# EAGLE schematic Module_control (EAGLE 9.4.2)

## Sheet 1 of 4
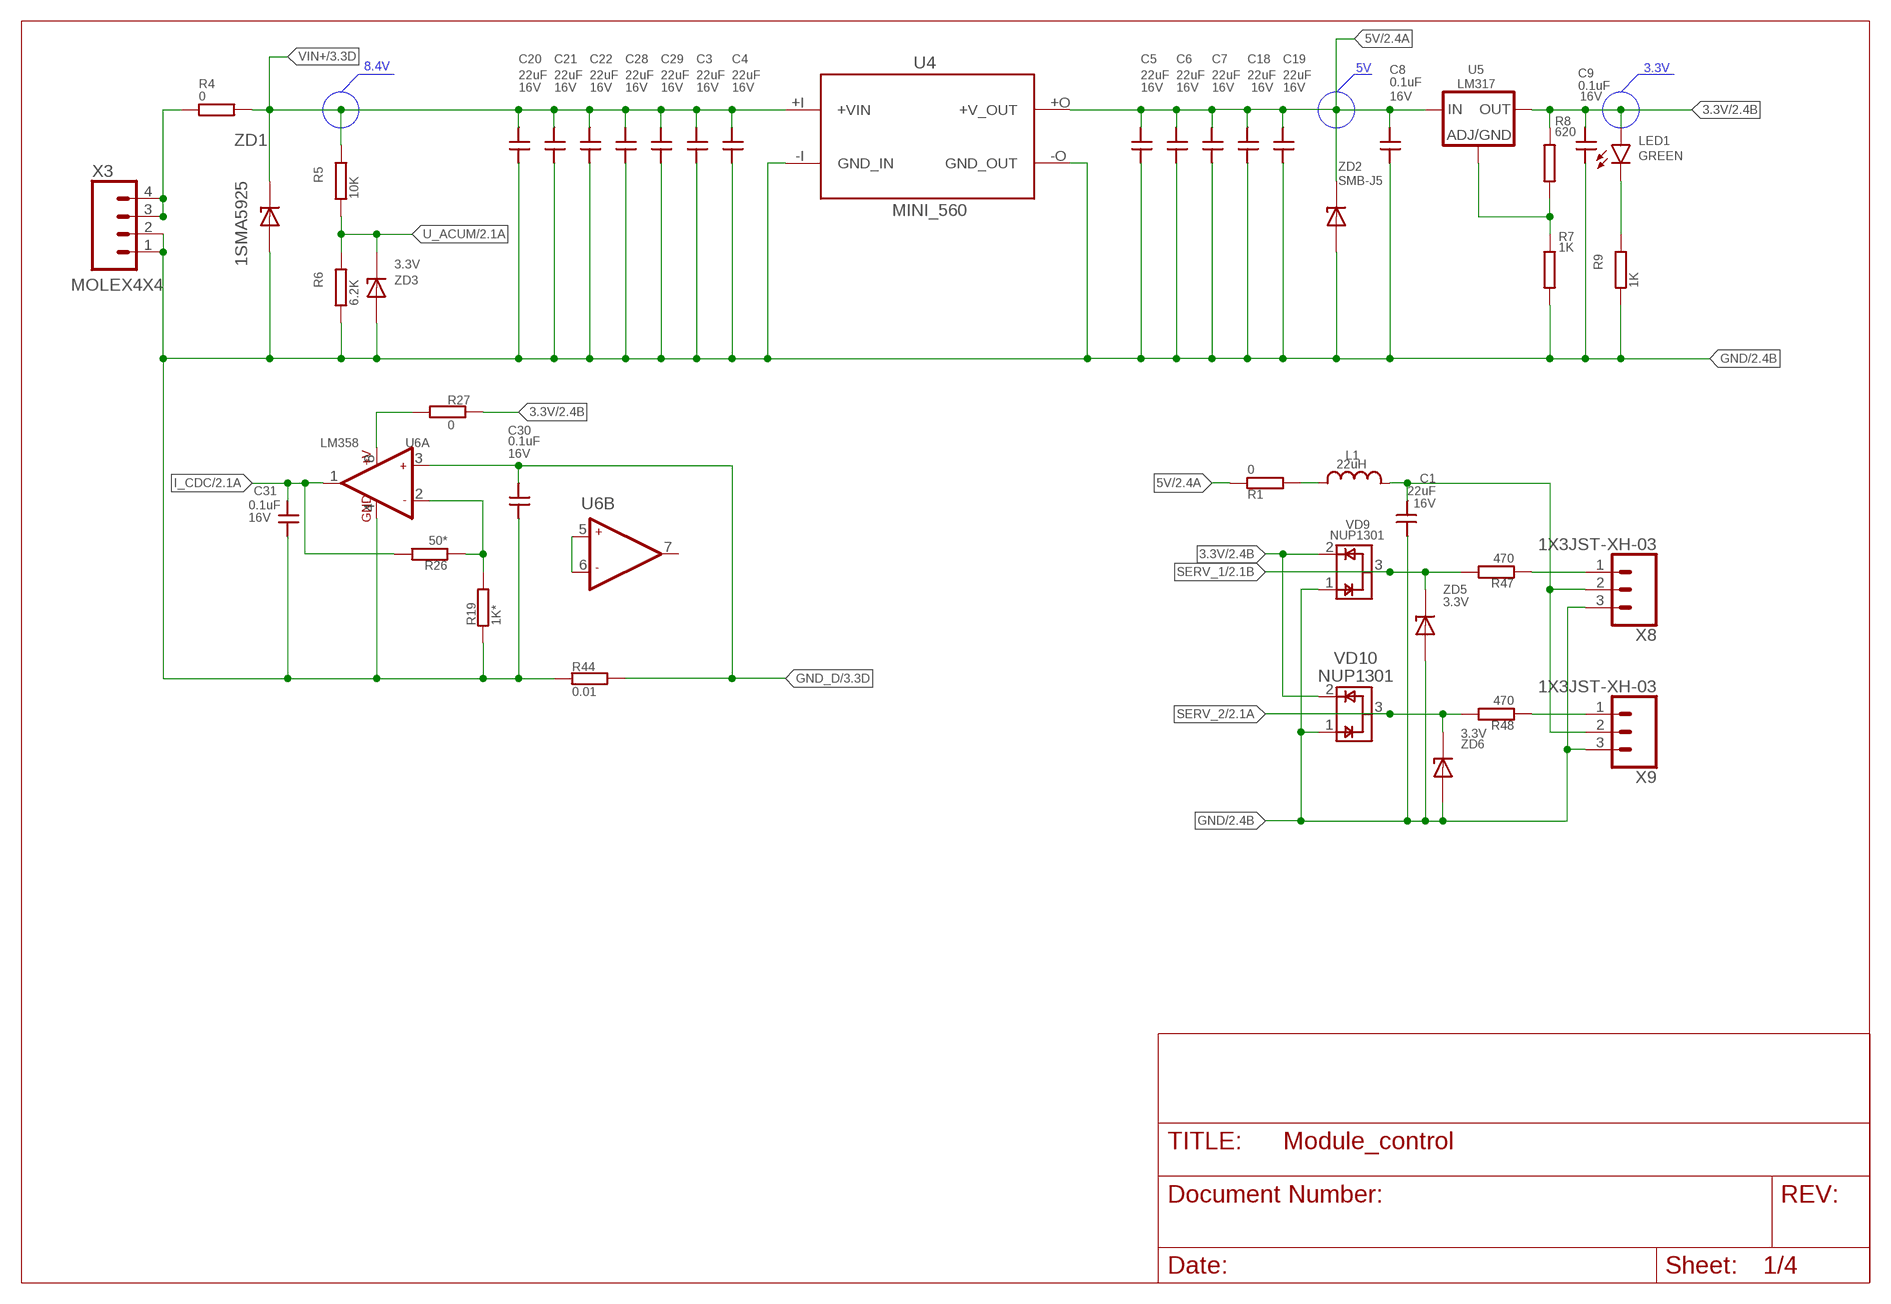
[diagram p0: schematic, sheet 1]

### Parts
C1  22uF  C1206  [1206]
C3  22uF  C1206  [1206]
C4  22uF  C1206  [1206]
C5  22uF  C1206  [1206]
C6  22uF  C1206  [1206]
C7  22uF  C1206  [1206]
C8  0.1uF  C0603  [0603]
C9  0.1uF  C0603  [0603]
C18  22uF  C1206  [1206]
C19  22uF  C1206  [1206]
C20  22uF  C1206  [1206]
C21  22uF  C1206  [1206]
C22  22uF  C1206  [1206]
C28  22uF  C1206  [1206]
C29  22uF  C1206  [1206]
C30  0.1uF  C0603  [0603]
C31  0.1uF  C0603  [0603]
L1  22uH  INDUCTOR0420CDMC  [0420CDMC]
LED1  GREEN  LED1608  [1608]
R1  0  R0603  [0603]
R4  0  R2512  [2512]
R5  10K  R0603  [0603]
R6  6.2K  R0603  [0603]
R7  1K  R0603  [0603]
R8  620  R0603  [0603]
R9  1K  R0603  [0603]
R19  1K*  R0603  [0603]
R26  50*  R0603  [0603]
R27  0  R0603  [0603]
R44  0.01  R1206  [1206]
R47  470  R0603  [0603]
R48  470  R0603  [0603]
U4  MINI_560  MINI560  [MINI560_OTB]
U5  LM317  [D-PAK]
U6  LM358  OPAMPDUALU  [SOIC-8]
VD9  NUP1301  ESD_PROTECTIONSOT123  [SOT23]
VD10  NUP1301  ESD_PROTECTIONSOT123  [SOT23]
X3  MOLEX4X4  1X4MOLEX-2X2U  [MOLEX-2X2U]
X8  1X3JST-XH-03  [JST-XH-03]
X9  1X3JST-XH-03  [JST-XH-03]
ZD1  1SMA5925  ZENER-DIODESSMB  [SMB]
ZD2  SMB-J5  ZENER-DIODESSMB  [SMB]
ZD3  3.3V  ZENER-DIODESMINIMELF  [MINIMELF]
ZD5  3.3V  ZENER-DIODESMINIMELF  [MINIMELF]
ZD6  3.3V  ZENER-DIODESMINIMELF  [MINIMELF]

### Nets
3.3V: C9.P$2 LED1.P$2(A) R8.P$2 R27.P$2 U5.4(OUT) VD9.2(VCC) VD10.2(VCC) ; also sheet 2,3,4
5: L1.2 R1.P$2
5V: C5.P$2 C6.P$2 C7.P$2 C8.P$2 C18.P$2 C19.P$2 R1.P$1 U4.+O(+V_OUT) U5.3(IN) ZD2.C ; also sheet 2,4
GND: C1.P$1 C3.P$1 C4.P$1 C5.P$1 C6.P$1 C7.P$1 C8.P$1 C9.P$1 C18.P$1 C19.P$1 C20.P$1 C21.P$1 C22.P$1 C28.P$1 C29.P$1 C30.P$1 C31.P$1 R6.P$1 R7.P$2 R9.P$1 R19.P$1 R44.P$1 U4.-I(GND_IN) U4.-O(GND_OUT) U6.4(A:GND) VD9.1(GND) VD10.1(GND) X3.1 X3.2 X8.3 X9.3 ZD1.A ZD2.A ZD3.A ZD5.A ZD6.A ; also sheet 2,3,4
GND_D: C30.P$2 R44.P$2 U6.3(A:+IN1) ; also sheet 3
I_CDC: C31.P$2 R26.P$2 U6.1(A:OUT1) ; also sheet 2
N$9: R48.P$1 X9.1
N$13: R7.P$1 R8.P$1 U5.1(ADJ/GND)
N$14: LED1.P$1(C) R9.P$2
N$16: R4.1 X3.3 X3.4
N$17: R47.P$1 X8.1
N$29: R19.P$2 R26.P$1 U6.2(A:-IN1)
N$32: U6.5(B:+IN2) U6.6(B:-IN2)
SERV_1: R47.P$2 VD9.3(I/O) ZD5.C ; also sheet 2
SERV_2: R48.P$2 VD10.3(I/O) ZD6.C ; also sheet 2
U_ACUM: R5.P$1 R6.P$2 ZD3.C ; also sheet 2
V+: R27.P$1 U6.8(A:+V)
VIN+: C3.P$2 C4.P$2 C20.P$2 C21.P$2 C22.P$2 C28.P$2 C29.P$2 R4.2 R5.P$2 U4.+I(+VIN) ZD1.C ; also sheet 3,4
VSERV: C1.P$2 L1.1 X8.2 X9.2
Unconnected: U6.7(B:OUT2)

### Notes on the sheet
- 8.4V | 5V | 3.3V

## Sheet 2 of 4
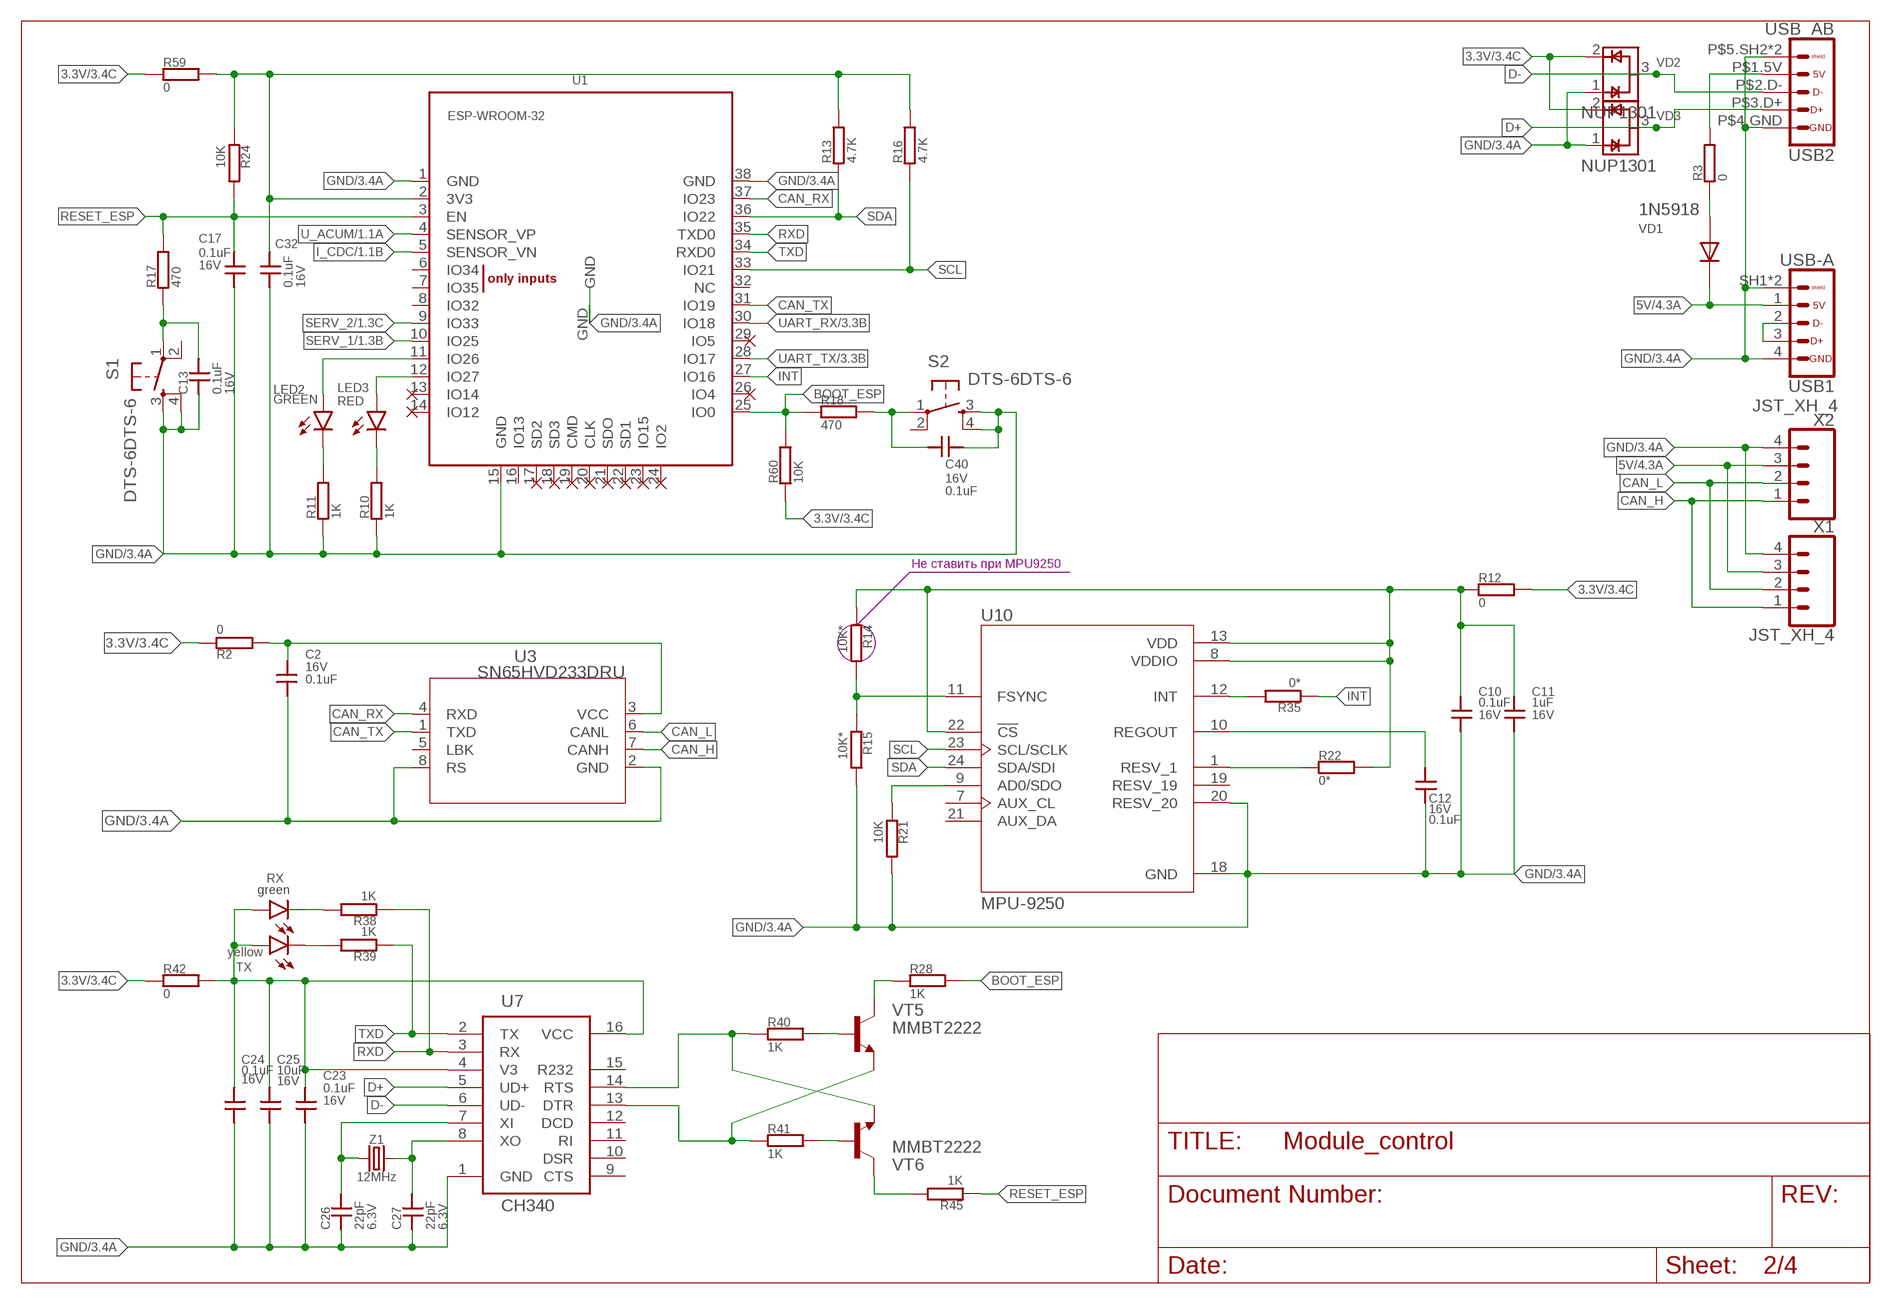
[diagram p1: schematic, sheet 2]

### Parts
C2  0.1uF  C0603  [0603]
C10  0.1uF  C0603  [0603]
C11  1uF  C0603  [0603]
C12  0.1uF  C0603  [0603]
C13  0.1uF  C0603  [0603]
C17  0.1uF  C0603  [0603]
C23  0.1uF  C0603  [0603]
C24  0.1uF  C0603  [0603]
C25  10uF  C0603  [0603]
C26  22pF  C0603  [0603]
C27  22pF  C0603  [0603]
C32  0.1uF  C0603  [0603]
C40  0.1uF  C0603  [0603]
LED2  GREEN  LED1608  [1608]
LED3  RED  LED1608  [1608]
R2  0  R0603  [0603]
R3  0  R0603  [0603]
R10  1K  R0603  [0603]
R11  1K  R0603  [0603]
R12  0  R0603  [0603]
R13  4.7K  R0603  [0603]
R14  10K*  R0603  [0603]
R15  10K*  R0603  [0603]
R16  4.7K  R0603  [0603]
R17  470  R0603  [0603]
R18  470  R0603  [0603]
R21  10K  R0603  [0603]
R22  0*  R0603  [0603]
R24  10K  R0603  [0603]
R28  1K  R0603  [0603]
R35  0*  R0603  [0603]
R38  1K  R0603  [0603]
R39  1K  R0603  [0603]
R40  1K  R0603  [0603]
R41  1K  R0603  [0603]
R42  0  R0603  [0603]
R45  1K  R0603  [0603]
R59  0  R0603  [0603]
R60  10K  R0603  [0603]
RX  green  LED2013  [2013]
S1  DTS-6DTS-6  [DTS-6]
S2  DTS-6DTS-6  [DTS-6]
TX  yellow  LED2013  [2013]
U1  ESP-WROOM-32  [ESP-WROOM-32]
U3  SN65HVD233DRU  [SOIC-8]
U7  CH340  [SOIC-16]
U10  MPU-9250  [QFN40P300X300X105-24N]
USB1  USB-A  [A-VERTICAL]
USB2  USB_AB  USB-B  [B-VERTICAL]
VD1  1N5918  DIODESOD-123  [SOD123]
VD2  NUP1301  ESD_PROTECTIONSOT123  [SOT23]
VD3  NUP1301  ESD_PROTECTIONSOT123  [SOT23]
VT5  MMBT2222  NPNSOT-23  [SOT-23]
VT6  MMBT2222  NPNSOT-23  [SOT-23]
X1  JST_XH_4  1X4JST-XH-04  [JST-XH-04]
X2  JST_XH_4  1X4JST-XH-04  [JST-XH-04]
Z1  12MHz  CRYSTAL4FOOT  [CRYSTAL-SMD-3.2X2.5MM]

### Nets
3.3V: R2.P$1 R12.P$2 R42.P$1 R59.P$1 R60.P$1 VD2.2(VCC) VD3.2(VCC) ; also sheet 1,3,4
5V: USB1.1 VD1.C X1.3 X2.3 ; also sheet 1,4
+3.3: C2.P$2 R2.P$2 U3.3(VCC)
+3V: C10.P$2 C11.P$2 R12.P$1 R14.P$1 R22.P$2 U10.8(VDDIO) U10.13(VDD) U10.22(!CS)
BOOT_ESP: R18.P$1 R28.P$2 R60.P$2 U1.25(IO0)
CAN_H: U3.7(CANH) X1.1 X2.1
CAN_L: U3.6(CANL) X1.2 X2.2
CAN_RX: U1.37(IO23) U3.4(RXD)
CAN_TX: U1.31(IO19) U3.1(TXD)
D+: U7.5(UD+) USB2.P$3.D+ VD3.3(I/O)
D-: U7.6(UD-) USB2.P$2.D- VD2.3(I/O)
DTR: R41.P$1 U7.13(DTR) VT5.2(E)
ESP_3.3V: C32.P$2 R13.P$2 R16.P$2 R24.P$1 R59.P$2 U1.2(3V3)
GND: C2.P$1 C10.P$1 C11.P$1 C12.P$1 C13.P$1 C17.P$1 C23.P$1 C24.P$1 C25.P$1 C26.P$1 C27.P$1 C32.P$1 C40.P$1 R10.P$1 R11.P$1 R15.P$2 R21.P$2 S1.3 S1.4 S2.3 S2.4 U1.1(GND) U1.15(GND) U1.38(GND) U1.GND U3.2(GND) U3.8(RS) U7.1(GND) U10.18(GND) U10.20(RESV_20) USB1.4 USB1.SH1(SHIELD) USB1.SH2(SHIELD) USB2.P$4.GND USB2.P$5.SH2(SHIELD) USB2.P$6.SH1(SHIELD) VD2.1(GND) VD3.1(GND) X1.4 X2.4 ; also sheet 1,3,4
I_CDC: U1.5(SENSOR_VN) ; also sheet 1
INT: R35.P$1 U1.27(IO16)
IT: R35.P$2 U10.12(INT)
N$3: C40.P$2 R18.P$2 S2.1
N$5: R3.P$2 USB2.P$1.5V
N$6: USB1.2 USB1.3
N$8: R3.P$1 VD1.A
N$12: LED2.P$2(A) U1.11(IO26)
N$15: LED3.P$2(A) U1.12(IO27)
N$18: LED3.P$1(C) R10.P$2
N$19: LED2.P$1(C) R11.P$2
N$22: R21.P$1 U10.9(AD0/SDO)
N$23: C12.P$2 U10.10(REGOUT)
N$25: R22.P$1 U10.1(RESV_1)
N$30: R38.P$2 RX.P$1(C)
N$31: R14.P$2 R15.P$1 U10.11(FSYNC)
N$33: R39.P$2 TX.P$1(C)
N$34: C27.P$2 U7.8(XO) Z1.3
N$35: C26.P$2 U7.7(XI) Z1.1
N$36: R40.P$2 VT5.1(B)
N$37: R41.P$2 VT6.1(B)
N$38: R28.P$1 VT5.3(C)
N$39: R45.P$2 VT6.3(C)
N$83: C13.P$2 R17.P$1 S1.1
RESET_ESP: C17.P$2 R17.P$2 R24.P$2 R45.P$1 U1.3(EN)
RTS: R40.P$1 U7.14(RTS) VT6.2(E)
RXD: R38.P$1 U1.35(TXD0) U7.3(RX)
SCL: R16.P$1 U1.33(IO21) U10.23(SCL/SCLK)
SDA: R13.P$1 U1.36(IO22) U10.24(SDA/SDI)
SERV_1: U1.10(IO25) ; also sheet 1
SERV_2: U1.9(IO33) ; also sheet 1
TXD: R39.P$1 U1.34(RXD0) U7.2(TX)
U_ACUM: U1.4(SENSOR_VP) ; also sheet 1
UART_RX: U1.30(IO18) ; also sheet 3
UART_TX: U1.28(IO17) ; also sheet 3
VCC: C23.P$2 C24.P$2 C25.P$2 R42.P$2 RX.P$2(A) TX.P$2(A) U7.4(V3) U7.16(VCC)
Unconnected: S1.2 S2.2 U1.6(IO34) U1.7(IO35) U1.8(IO32) U1.13(IO14) U1.14(IO12) U1.16(IO13) U1.17(SD2) U1.18(SD3) U1.19(CMD) U1.20(CLK) U1.21(SDO) U1.22(SD1) U1.23(IO15) U1.24(IO2) U1.26(IO4) U1.29(IO5) U1.32(NC) U3.5(LBK) U7.9(CTS) U7.10(DSR) U7.11(RI) U7.12(DCD) U7.15(R232) U10.7(AUX_CL) U10.19(RESV_19) U10.21(AUX_DA)

### Notes on the sheet
- Не ставить при MPU9250

## Sheet 3 of 4
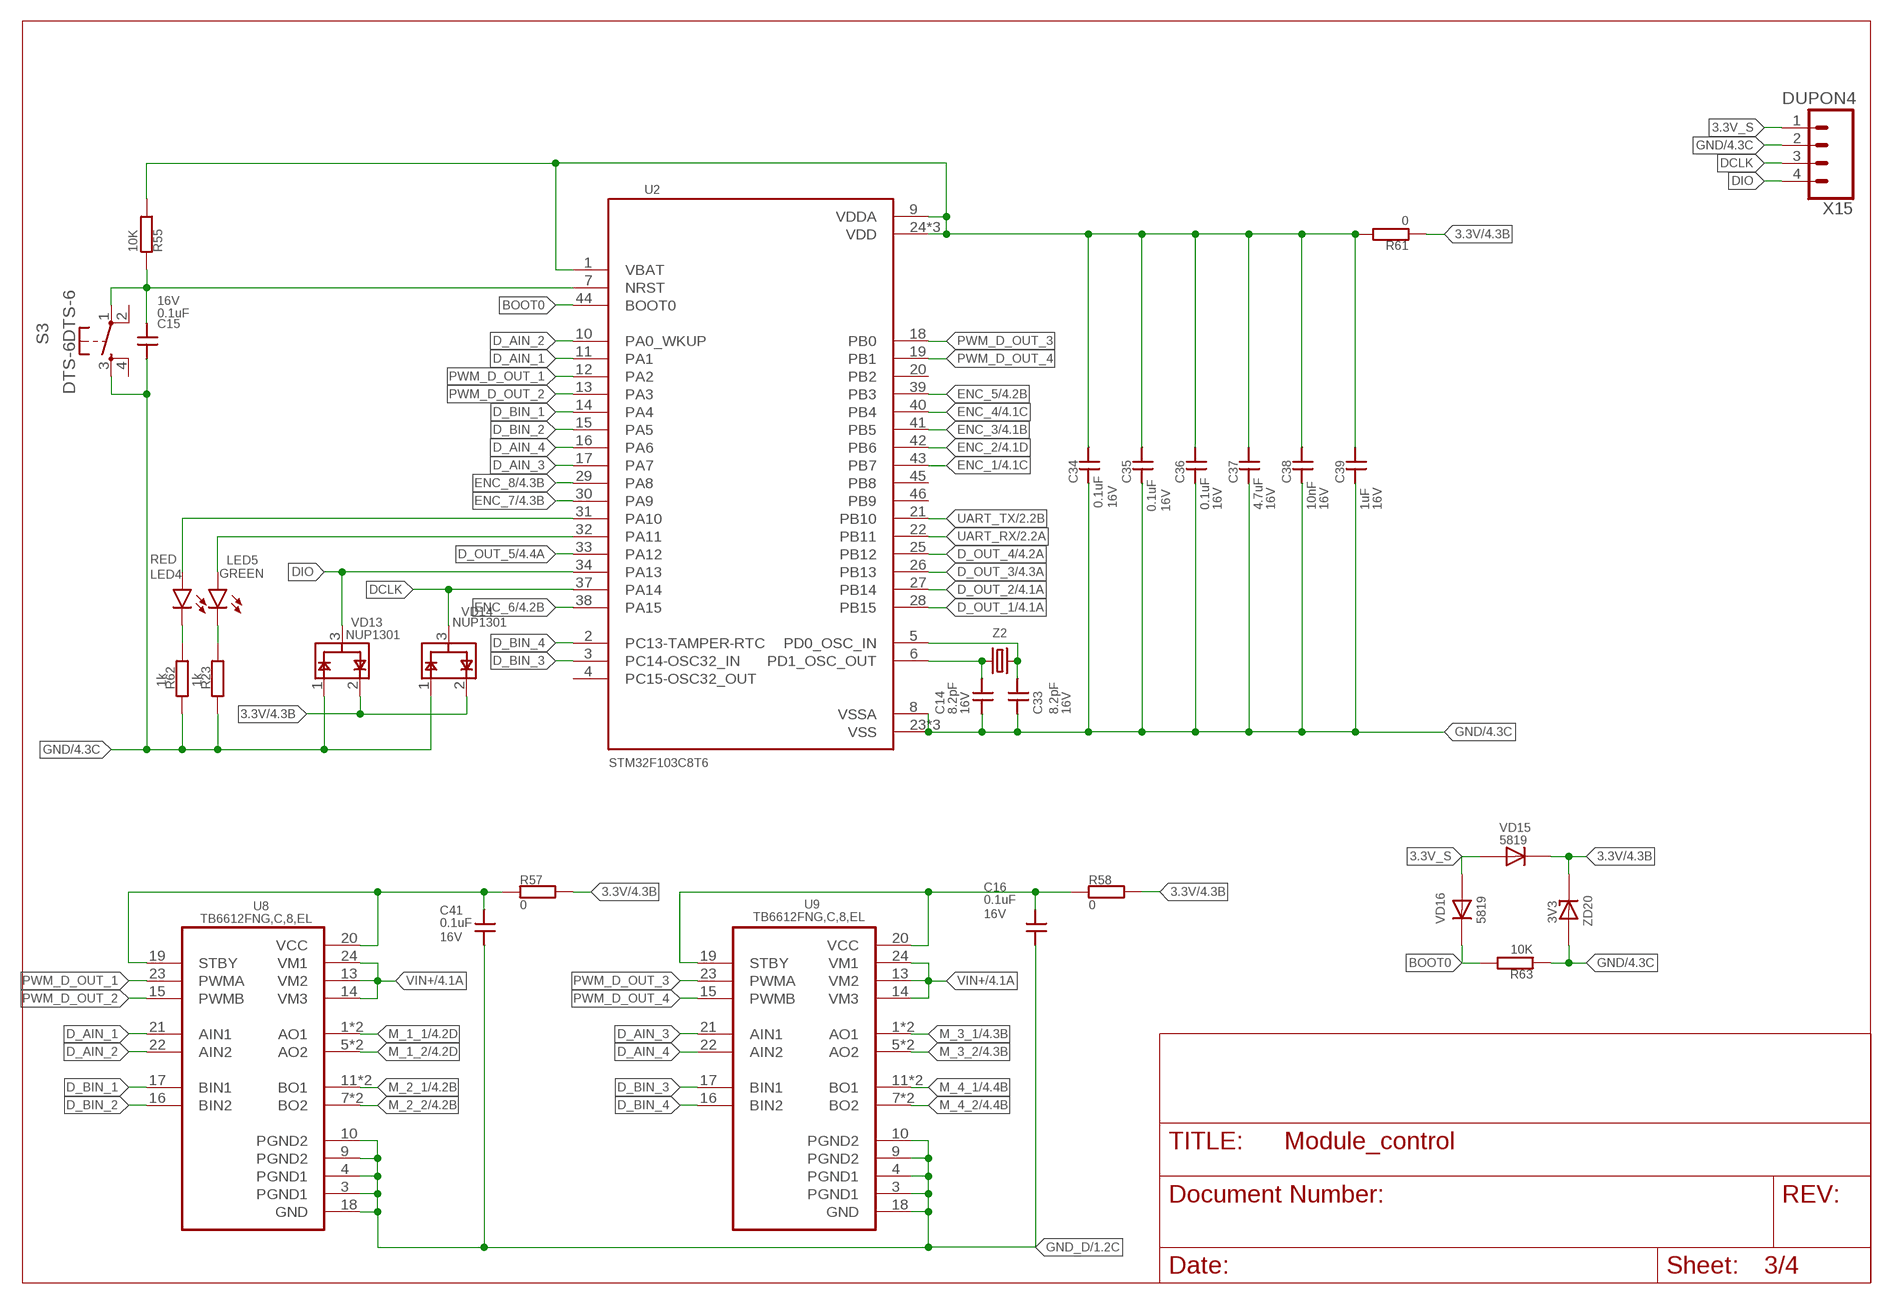
[diagram p2: schematic, sheet 3]

### Parts
C14  8.2pF  C0603  [0603]
C15  0.1uF  C0603  [0603]
C16  0.1uF  C0603  [0603]
C33  8.2pF  C0603  [0603]
C34  0.1uF  C0603  [0603]
C35  0.1uF  C0603  [0603]
C36  0.1uF  C0603  [0603]
C37  4.7uF  C0603  [0603]
C38  10nF  C0603  [0603]
C39  1uF  C0603  [0603]
C41  0.1uF  C0603  [0603]
LED4  RED  LED1608  [1608]
LED5  GREEN  LED1608  [1608]
R23  1k  R0603  [0603]
R55  10K  R0603  [0603]
R57  0  R0603  [0603]
R58  0  R0603  [0603]
R61  0  R0603  [0603]
R62  1k  R0603  [0603]
R63  10K  R0603  [0603]
S3  DTS-6DTS-6  [DTS-6]
U2  STM32F103C8T6  [QFP50P900X900X160-48N]
U8  TB6612FNG,C,8,EL  [SOP65]
U9  TB6612FNG,C,8,EL  [SOP65]
VD13  NUP1301  ESD_PROTECTIONSOT123  [SOT23]
VD14  NUP1301  ESD_PROTECTIONSOT123  [SOT23]
VD15  5819  DIODESOD-123  [SOD123]
VD16  5819  DIODESOD-123  [SOD123]
X15  DUPON4  1X4DUPON  [1X04DUPON]
Z2  8MHz  CRYSTAL4FOOT  [CRYSTAL-SMD-3.2X2.5MM]
ZD20  3V3  ZENER-DIODESMINIMELF  [MINIMELF]

### Nets
3.3V: R57.P$2 R58.P$2 R61.P$1 VD13.2(VCC) VD14.2(VCC) VD15.C ZD20.C ; also sheet 1,2,4
3.3V_S: VD15.A VD16.A X15.1
+VC: C41.P$2 R57.P$1 U8.19(STBY) U8.20(VCC)
BOOT0: R63.P$2 U2.44(BOOT0) VD16.C
D_AIN_1: U2.11(PA1) U8.21(AIN1)
D_AIN_2: U2.10(PA0_WKUP) U8.22(AIN2)
D_AIN_3: U2.17(PA7) U9.21(AIN1)
D_AIN_4: U2.16(PA6) U9.22(AIN2)
D_BIN_1: U2.14(PA4) U8.17(BIN1)
D_BIN_2: U2.15(PA5) U8.16(BIN2)
D_BIN_3: U2.3(PC14-OSC32_IN) U9.17(BIN1)
D_BIN_4: U2.2(PC13-TAMPER-RTC) U9.16(BIN2)
D_OUT_1: U2.28(PB15) ; also sheet 4
D_OUT_2: U2.27(PB14) ; also sheet 4
D_OUT_3: U2.26(PB13) ; also sheet 4
D_OUT_4: U2.25(PB12) ; also sheet 4
D_OUT_5: U2.33(PA12) ; also sheet 4
DCLK: U2.37(PA14) VD14.3(I/O) X15.3
DIO: U2.34(PA13) VD13.3(I/O) X15.4
ENC_1: U2.43(PB7) ; also sheet 4
ENC_2: U2.42(PB6) ; also sheet 4
ENC_3: U2.41(PB5) ; also sheet 4
ENC_4: U2.40(PB4) ; also sheet 4
ENC_5: U2.39(PB3) ; also sheet 4
ENC_6: U2.38(PA15) ; also sheet 4
ENC_7: U2.30(PA9) ; also sheet 4
ENC_8: U2.29(PA8) ; also sheet 4
GND: C14.P$1 C15.P$2 C33.P$1 C34.P$1 C35.P$1 C36.P$1 C37.P$1 C38.P$1 C39.P$1 R23.P$2 R62.P$2 R63.P$1 S3.3 U2.8(VSSA) U2.23(VSS) U2.35(VSS) U2.47(VSS) VD13.1(GND) VD14.1(GND) X15.2 ZD20.A ; also sheet 1,2,4
GND_D: C16.P$1 C41.P$1 U8.3(PGND1) U8.4(PGND1) U8.9(PGND2) U8.10(PGND2) U8.18(GND) U9.3(PGND1) U9.4(PGND1) U9.9(PGND2) U9.10(PGND2) U9.18(GND) ; also sheet 1
M_1_1: U8.1(AO1) U8.2(AO1) ; also sheet 4
M_1_2: U8.5(AO2) U8.6(AO2) ; also sheet 4
M_2_1: U8.11(BO1) U8.12(BO1) ; also sheet 4
M_2_2: U8.7(BO2) U8.8(BO2) ; also sheet 4
M_3_1: U9.1(AO1) U9.2(AO1) ; also sheet 4
M_3_2: U9.5(AO2) U9.6(AO2) ; also sheet 4
M_4_1: U9.11(BO1) U9.12(BO1) ; also sheet 4
M_4_2: U9.7(BO2) U9.8(BO2) ; also sheet 4
N$21: LED4.P$1(C) R62.P$1
N$42: C16.P$2 R58.P$1 U9.19(STBY) U9.20(VCC)
N$54: LED5.P$1(C) R23.P$1
N$58: LED4.P$2(A) U2.31(PA10)
N$87: LED5.P$2(A) U2.32(PA11)
N$89: C14.P$2 U2.6(PD1_OSC_OUT) Z2.1
N$90: C33.P$2 U2.5(PD0_OSC_IN) Z2.3
NRST: C15.P$1 R55.P$1 S3.1 U2.7(NRST)
PWM_D_OUT_1: U2.12(PA2) U8.23(PWMA)
PWM_D_OUT_2: U2.13(PA3) U8.15(PWMB)
PWM_D_OUT_3: U2.18(PB0) U9.23(PWMA)
PWM_D_OUT_4: U2.19(PB1) U9.15(PWMB)
UART_RX: U2.22(PB11) ; also sheet 2
UART_TX: U2.21(PB10) ; also sheet 2
VDD1: C34.P$2 C35.P$2 C36.P$2 C37.P$2 C38.P$2 C39.P$2 R55.P$2 R61.P$2 U2.1(VBAT) U2.9(VDDA) U2.24(VDD) U2.36(VDD) U2.48(VDD)
VIN+: U8.13(VM2) U8.14(VM3) U8.24(VM1) U9.13(VM2) U9.14(VM3) U9.24(VM1) ; also sheet 1,4
Unconnected: S3.2 S3.4 U2.4(PC15-OSC32_OUT) U2.20(PB2) U2.45(PB8) U2.46(PB9)

## Sheet 4 of 4
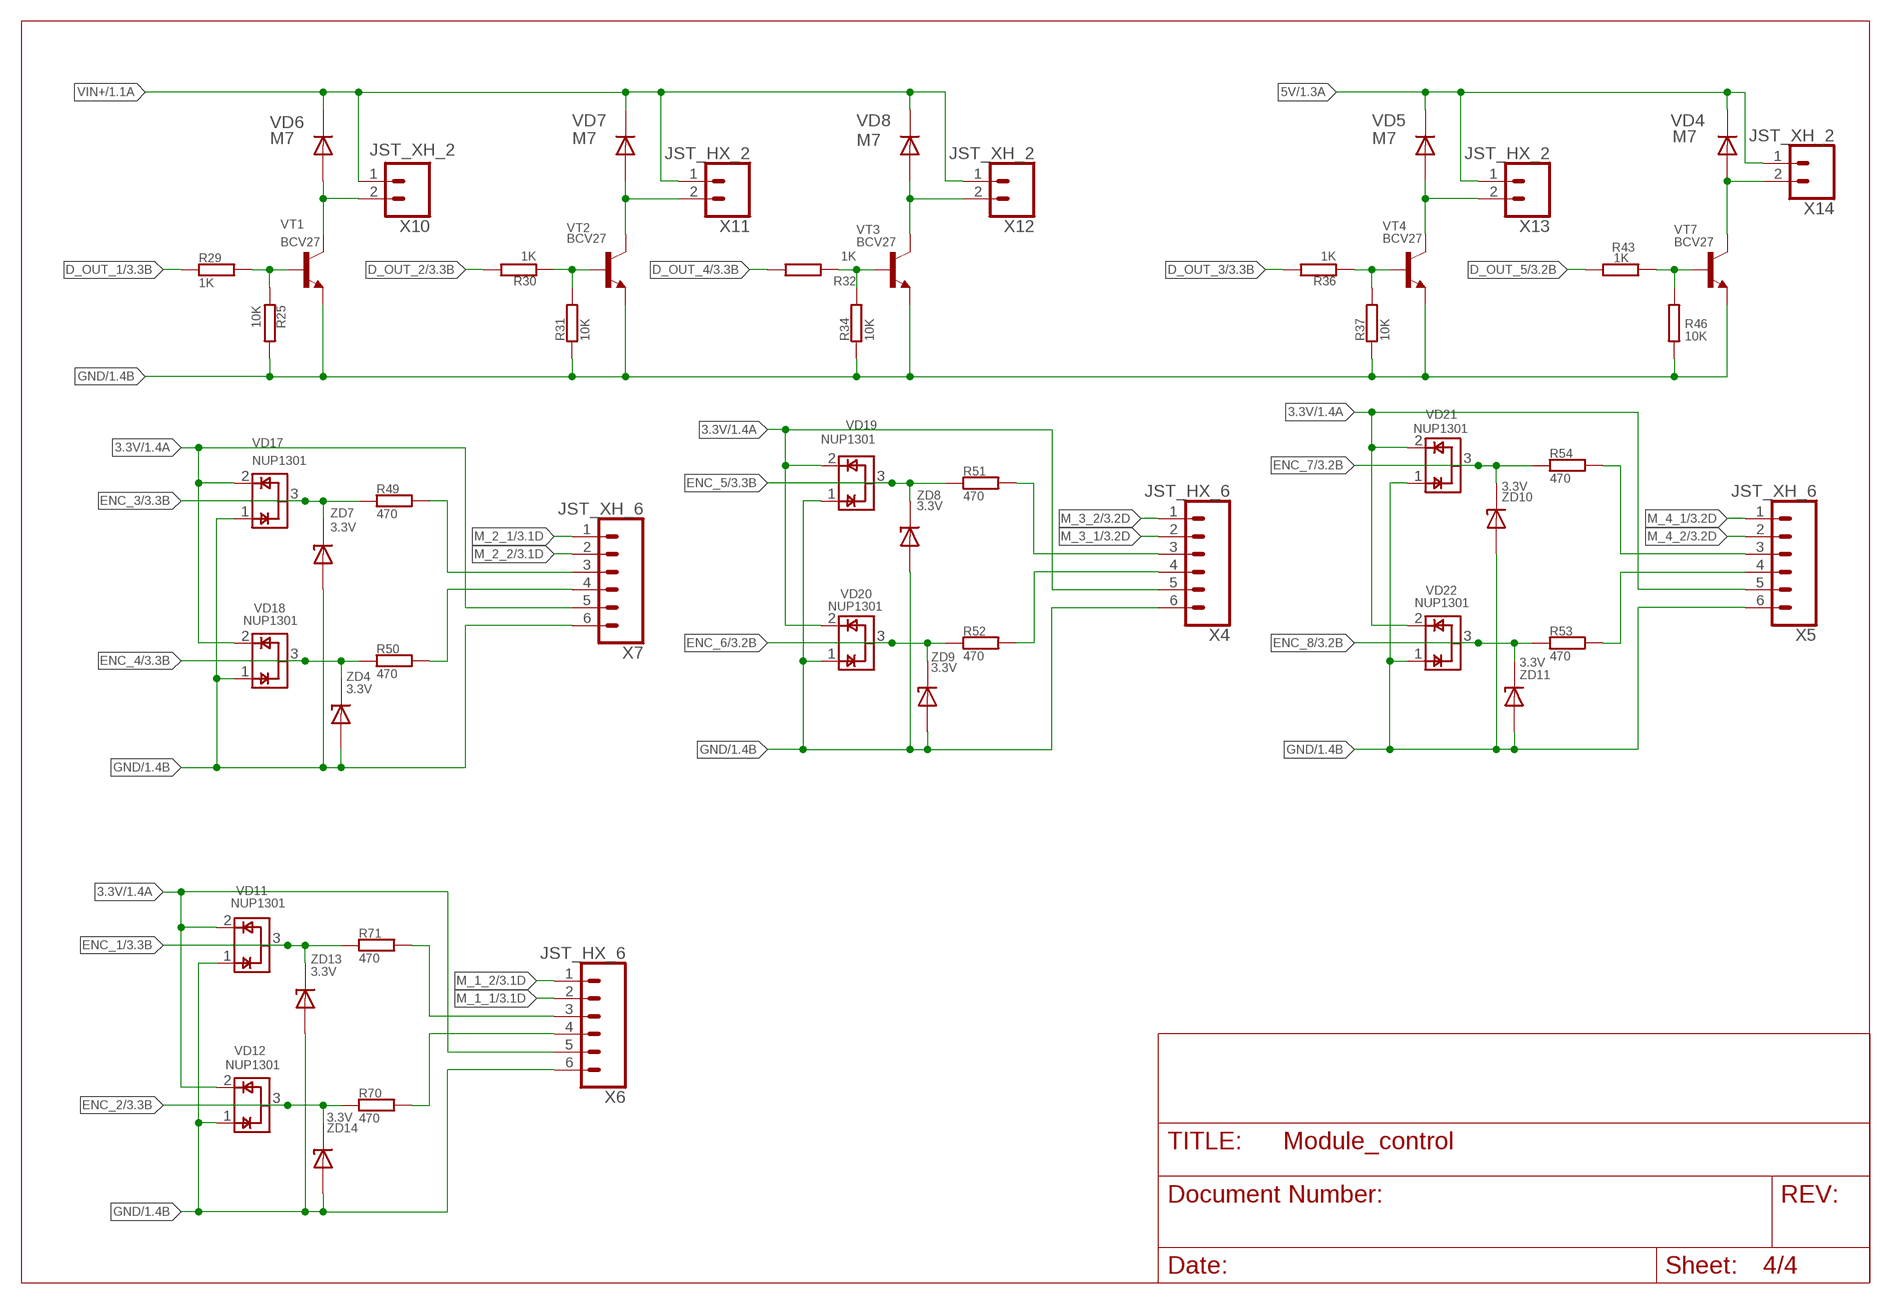
[diagram p3: schematic, sheet 4]

### Parts
R25  10K  R0603  [0603]
R29  1K  R0603  [0603]
R30  1K  R0603  [0603]
R31  10K  R0603  [0603]
R32  1K  R0603  [0603]
R34  10K  R0603  [0603]
R36  1K  R0603  [0603]
R37  10K  R0603  [0603]
R43  1K  R0603  [0603]
R46  10K  R0603  [0603]
R49  470  R0603  [0603]
R50  470  R0603  [0603]
R51  470  R0603  [0603]
R52  470  R0603  [0603]
R53  470  R0603  [0603]
R54  470  R0603  [0603]
R70  470  R0603  [0603]
R71  470  R0603  [0603]
VD4  M7  DIODESMA  [SMA]
VD5  M7  DIODESMA  [SMA]
VD6  M7  DIODESMA  [SMA]
VD7  M7  DIODESMA  [SMA]
VD8  M7  DIODESMA  [SMA]
VD11  NUP1301  ESD_PROTECTIONSOT123  [SOT23]
VD12  NUP1301  ESD_PROTECTIONSOT123  [SOT23]
VD17  NUP1301  ESD_PROTECTIONSOT123  [SOT23]
VD18  NUP1301  ESD_PROTECTIONSOT123  [SOT23]
VD19  NUP1301  ESD_PROTECTIONSOT123  [SOT23]
VD20  NUP1301  ESD_PROTECTIONSOT123  [SOT23]
VD21  NUP1301  ESD_PROTECTIONSOT123  [SOT23]
VD22  NUP1301  ESD_PROTECTIONSOT123  [SOT23]
VT1  BCV27  NPNSOT-23  [SOT-23]
VT2  BCV27  NPNSOT-23  [SOT-23]
VT3  BCV27  NPNSOT-23  [SOT-23]
VT4  BCV27  NPNSOT-23  [SOT-23]
VT7  BCV27  NPNSOT-23  [SOT-23]
X4  JST_HX_6  1X6JST-XH-06  [JST-XH-06]
X5  JST_XH_6  1X6JST-XH-06  [JST-XH-06]
X6  JST_HX_6  1X6JST-XH-06  [JST-XH-06]
X7  JST_XH_6  1X6JST-XH-06  [JST-XH-06]
X10  JST_XH_2  1X2JST-XH-02  [JST-XH-02]
X11  JST_HX_2  1X2JST-XH-02  [JST-XH-02]
X12  JST_XH_2  1X2JST-XH-02  [JST-XH-02]
X13  JST_HX_2  1X2JST-XH-02  [JST-XH-02]
X14  JST_XH_2  1X2JST-XH-02  [JST-XH-02]
ZD4  3.3V  ZENER-DIODESMINIMELF  [MINIMELF]
ZD7  3.3V  ZENER-DIODESMINIMELF  [MINIMELF]
ZD8  3.3V  ZENER-DIODESMINIMELF  [MINIMELF]
ZD9  3.3V  ZENER-DIODESMINIMELF  [MINIMELF]
ZD10  3.3V  ZENER-DIODESMINIMELF  [MINIMELF]
ZD11  3.3V  ZENER-DIODESMINIMELF  [MINIMELF]
ZD13  3.3V  ZENER-DIODESMINIMELF  [MINIMELF]
ZD14  3.3V  ZENER-DIODESMINIMELF  [MINIMELF]

### Nets
3.3V: VD11.2(VCC) VD12.2(VCC) VD17.2(VCC) VD18.2(VCC) VD19.2(VCC) VD20.2(VCC) VD21.2(VCC) VD22.2(VCC) X4.5 X5.5 X6.5 X7.5 ; also sheet 1,2,3
5V: VD4.C VD5.C X13.1 X14.1 ; also sheet 1,2
D_OUT_1: R29.P$1 ; also sheet 3
D_OUT_2: R30.P$2 ; also sheet 3
D_OUT_3: R36.P$2 ; also sheet 3
D_OUT_4: R32.P$2 ; also sheet 3
D_OUT_5: R43.P$2 ; also sheet 3
ENC1: R71.P$2 X6.3
ENC2: R70.P$2 X6.4
ENC3: R49.P$2 X7.3
ENC4: R50.P$2 X7.4
ENC5: R51.P$2 X4.3
ENC6: R52.P$2 X4.4
ENC7: R54.P$2 X5.3
ENC8: R53.P$2 X5.4
ENC_1: R71.P$1 VD11.3(I/O) ZD13.C ; also sheet 3
ENC_2: R70.P$1 VD12.3(I/O) ZD14.C ; also sheet 3
ENC_3: R49.P$1 VD17.3(I/O) ZD7.C ; also sheet 3
ENC_4: R50.P$1 VD18.3(I/O) ZD4.C ; also sheet 3
ENC_5: R51.P$1 VD19.3(I/O) ZD8.C ; also sheet 3
ENC_6: R52.P$1 VD20.3(I/O) ZD9.C ; also sheet 3
ENC_7: R54.P$1 VD21.3(I/O) ZD10.C ; also sheet 3
ENC_8: R53.P$1 VD22.3(I/O) ZD11.C ; also sheet 3
GND: R25.P$2 R31.P$1 R34.P$1 R37.P$1 R46.P$1 VD11.1(GND) VD12.1(GND) VD17.1(GND) VD18.1(GND) VD19.1(GND) VD20.1(GND) VD21.1(GND) VD22.1(GND) VT1.2(E) VT2.2(E) VT3.2(E) VT4.2(E) VT7.2(E) X4.6 X5.6 X6.6 X7.6 ZD4.A ZD7.A ZD8.A ZD9.A ZD10.A ZD11.A ZD13.A ZD14.A ; also sheet 1,2,3
M_1_1: X6.2 ; also sheet 3
M_1_2: X6.1 ; also sheet 3
M_2_1: X7.1 ; also sheet 3
M_2_2: X7.2 ; also sheet 3
M_3_1: X4.2 ; also sheet 3
M_3_2: X4.1 ; also sheet 3
M_4_1: X5.1 ; also sheet 3
M_4_2: X5.2 ; also sheet 3
N$41: R25.P$1 R29.P$2 VT1.1(B)
N$43: VD6.A VT1.3(C) X10.2
N$45: R30.P$1 R31.P$2 VT2.1(B)
N$47: R36.P$1 R37.P$2 VT4.1(B)
N$48: VD7.A VT2.3(C) X11.2
N$50: VD8.A VT3.3(C) X12.2
N$52: VD5.A VT4.3(C) X13.2
N$53: R32.P$1 R34.P$2 VT3.1(B)
N$56: R43.P$1 R46.P$2 VT7.1(B)
N$59: VD4.A VT7.3(C) X14.2
VIN+: VD6.C VD7.C VD8.C X10.1 X11.1 X12.1 ; also sheet 1,3

## Library data of the parts
C1-C25 C28-C41 = LARS_409_R,C,L:C; VOLTAGE: 16V
C26 C27 = LARS_409_R,C,L:C; VOLTAGE: 6.3V
L1 = LARS_409_INDUCTOR:INDUCTOR
LED1-LED5 RX TX = LARS_409_LED:LED
R1-R19 R21-R32 R34-R55 R57-R63 R70 R71 = LARS_409_R,C,L:R
S1-S3 = LARS_409_SWITCH:DTS-6
U1 = LARS_409_MK:ESP-WROOM-32
U2 = LARS_409_MK:STM32F103C8T6
U3 = LARS_409_MC:SN65HVD233DR
U4 = LARS_409_DC-DC:MINI560
U5 = LARS_409_DC-DC:LM317
U6 = LARS_409_MC:OPAMPDUAL
U7 = LARS_409_MC:CH340
U8 U9 = LARS_409_MC:TB6612FNG,C,8,EL: Stepping Motor Driver Ic Unipolor Copper Wire 8" Check prices <https://pricing.snapeda.com/parts/TB6612FNG%2CC%2C8%2CEL/Toshiba/view-part?ref=eda>
U10 = LARS_409_SENSORS:MPU-9250: Axis=3 Axis Gyro+3 Axis Accel+Compass. Pin For Pin With m Check prices <https://pricing.snapeda.com/parts/MPU-9250/TDK%20InvenSense/view-part?ref=eda>; AVAILABILITY: Bad; DESCRIPTION: Accelerometer, Gyroscope, Magnetometer, 9 Axis Sensor I²C, SPI Output; MF: TDK InvenSense; MP: MPU-9250; PACKAGE: TFQFN-24 TDK InvenSense; PRICE: None
USB1 = LARS_409_USB:USB-A
USB2 = LARS_409_USB:USB-B
VD1 VD4-VD8 VD15 VD16 = LARS_409_DIODE:DIODE
VD2 VD3 VD9-VD14 VD17-VD22 = LARS_409_DIODE:ESD_PROTECTION
VT1-VT7 = LARS_409_TRANSISTORS:NPN
X1-X3 X15 = LARS_409_CONNECTORS:1X4
X4-X7 = LARS_409_CONNECTORS:1X6
X8 X9 = LARS_409_CONNECTORS:1X3
X10-X14 = LARS_409_CONNECTORS:1X2
Z1 Z2 = LARS_409_CLOCKS:CRYSTAL
ZD1-ZD11 ZD13 ZD14 ZD20 = LARS_409_DIODE:ZENER-DIODES